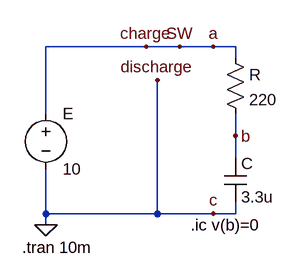
[diagram p0: schematic Draft10.asc]
Draft10.asc, the LTspice schematic file:
Version 4
SHEET 1 880 680
WIRE 224 48 80 48
WIRE 272 48 224 48
WIRE 320 48 272 48
WIRE 352 48 320 48
WIRE 352 64 352 48
WIRE 80 144 80 48
WIRE 352 176 352 144
WIRE 352 208 352 176
WIRE 80 288 80 224
WIRE 240 288 240 96
WIRE 240 288 80 288
WIRE 320 288 240 288
WIRE 352 288 352 272
WIRE 352 288 320 288
WIRE 80 304 80 288
FLAG 80 304 0
FLAG 224 48 charge
FLAG 272 48 SW
FLAG 240 96 discharge
FLAG 320 48 a
FLAG 352 176 b
FLAG 320 288 c
SYMBOL voltage 80 128 R0
WINDOW 123 0 0 Left 0
WINDOW 39 0 0 Left 0
SYMATTR InstName E
SYMATTR Value 10
SYMBOL res 336 48 R0
SYMATTR InstName R
SYMATTR Value 220
SYMATTR SpiceLine tol=1 pwr=0.1
SYMBOL cap 336 208 R0
SYMATTR InstName C
SYMATTR Value 3.3u
TEXT 288 304 Left 2 !.ic v(b)=0
TEXT 46 336 Left 2 !.tran 10m

The netlist it stands for:
* Draft10.asc
V§E a 0 10
R a b 220 tol=1 pwr=0.1
C b 0 3.3u
.ic v(b)=0
.tran 10m
.backanno
.end

* Results of the author's LTspice run, read from the files saved beside the schematic
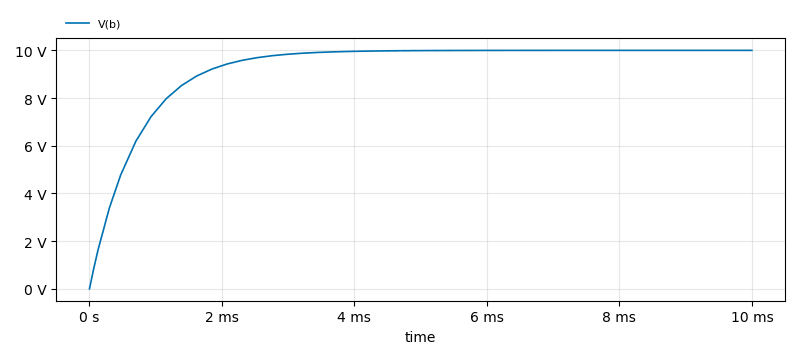
[diagram p1: Transient Analysis of Draft10.asc, plotted from the saved traces]
* Transient Analysis, 1 run:
*   V(b): min 0 V, max 10 V, average 9.27 V, rms 9.439 V, last 10 V